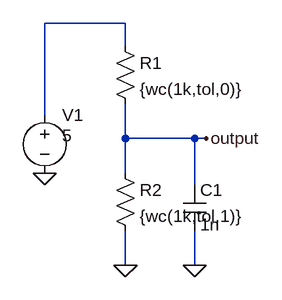
[diagram p0: schematic Montecarlo_3.asc]
Montecarlo_3.asc, the LTspice schematic file:
Version 4.1
SHEET 1 880 680
WIRE 96 -176 -16 -176
WIRE 96 -144 96 -176
WIRE -16 -48 -16 -176
WIRE 96 -16 96 -64
WIRE 192 -16 96 -16
WIRE 208 -16 192 -16
WIRE 96 32 96 -16
WIRE 192 48 192 -16
WIRE 96 160 96 112
WIRE 192 160 192 112
FLAG -16 32 0
FLAG 96 160 0
FLAG 208 -16 output
FLAG 192 160 0
SYMBOL res 80 -160 R0
SYMATTR InstName R1
SYMATTR Value {wc(1k,tol,0)}
SYMBOL res 80 16 R0
SYMATTR InstName R2
SYMATTR Value {wc(1k,tol,1)}
SYMBOL voltage -16 -64 R0
WINDOW 123 24 124 Left 2
WINDOW 39 0 0 Left 0
WINDOW 3 24 44 Left 2
SYMATTR InstName V1
SYMATTR Value 5
SYMBOL cap 176 48 R0
SYMATTR InstName C1
SYMATTR Value 1n

The netlist it stands for:
* Montecarlo_3.asc
R1 N001 output {wc(1k,tol,0)}
R2 output 0 {wc(1k,tol,1)}
V1 N001 0 5
C1 output 0 1n
.backanno
.end